# Altium schematic sheet BMS_Interface.SchDoc
size Letter; Website: www.uwmidsun.com
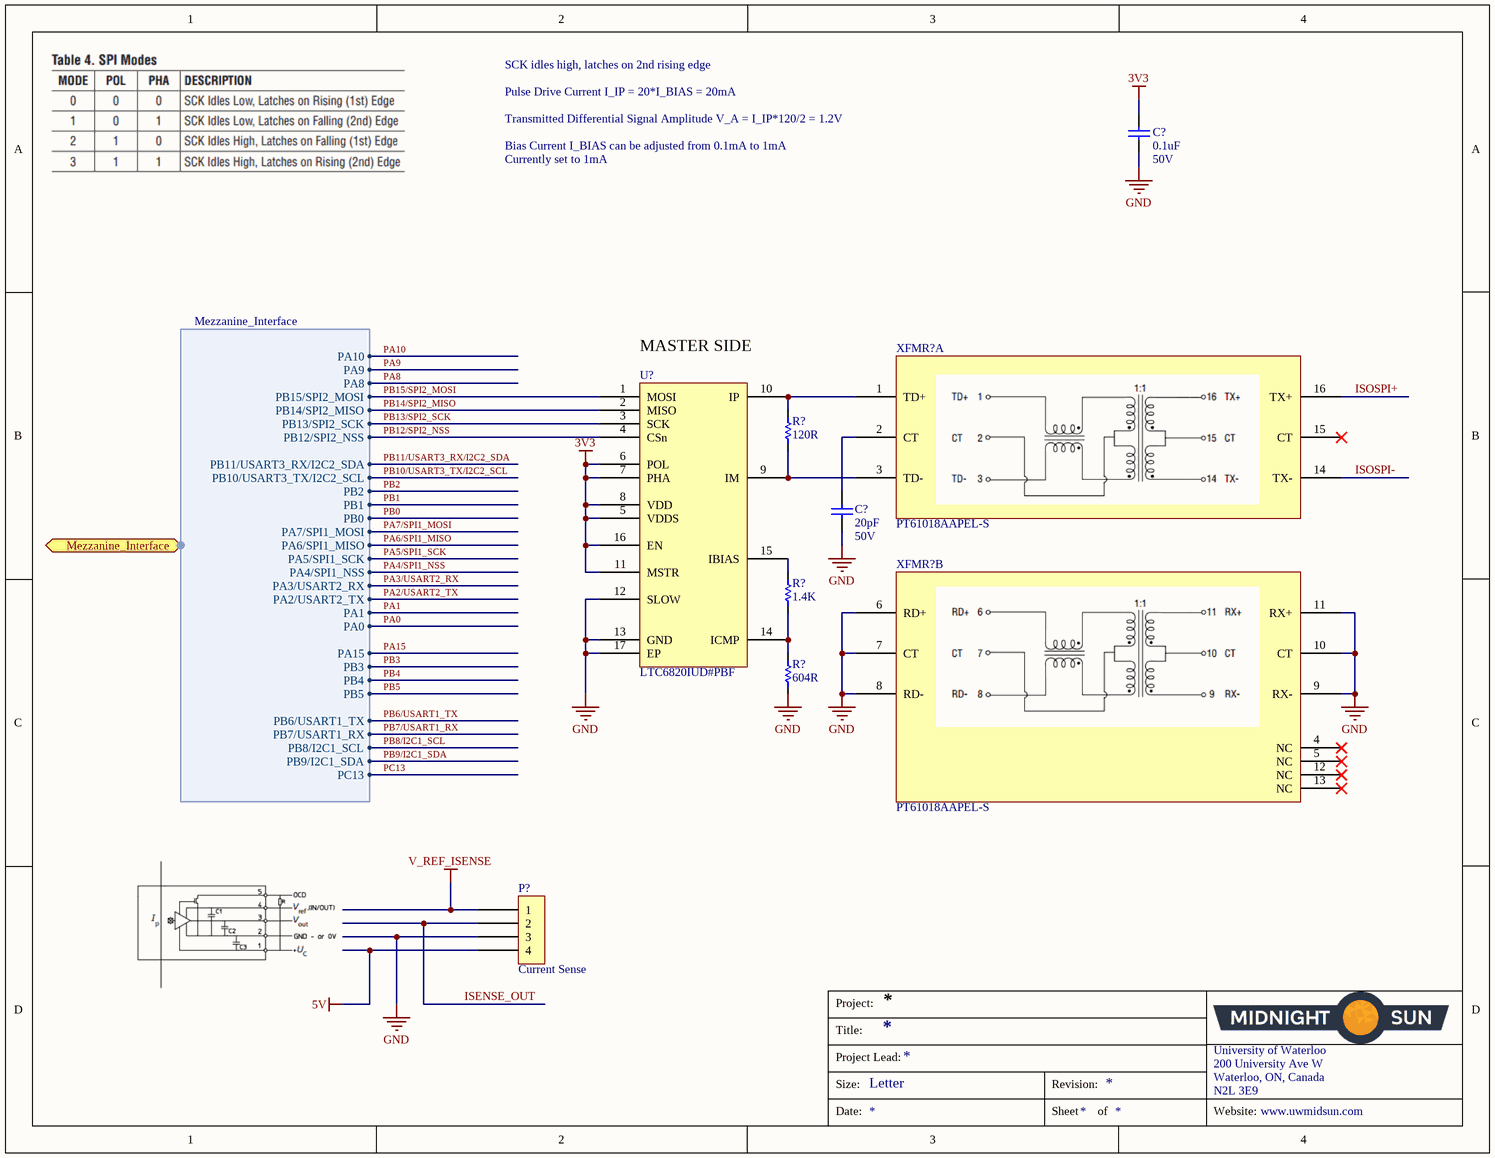
[diagram p0: BMS_Interface.SchDoc]

## Parts
(Parts that share a designator on the sheet are numbered #1, #2 ... from top to bottom, then left to right.)
C?#1  0.1uF  Voltage: 50V  [CAPC1608X06N]
C?#2  20pF  Voltage: 50V  [CAPC1608X06N]
P?  Current Sense  [WM4781CT-ND]
R?#1  120R  [RESC1608X06N]
R?#2  1.4K  [RESC1608X06N]
R?#3  604R  [RESC1608X06N]
U?  Manufacturer_PN: LTC6820IUD#PBF  (hidden comment: IC, LTC6820IUD#PBF)
XFMR?#1  MFG_PN: PT61018AAPEL-S  [IC, PULSE XFMR 1CT:1CT 350UH SMD]  (hidden comment: IC, PULSE XFMR 1CT:1CT 350UH SMD)  (part A of 2)
XFMR?#2  MFG_PN: PT61018AAPEL-S  [IC, PULSE XFMR 1CT:1CT 350UH SMD]  (hidden comment: IC, PULSE XFMR 1CT:1CT 350UH SMD)  (part B of 2)

## Ports
Mezzanine_Interface (harness Mezzanine_Interface)

## Harnesses
Mezzanine_Interface: PA10, PA9, PA8, PB15/SPI2_MOSI, PB14/SPI2_MISO, PB13/SPI2_SCK, PB12/SPI2_NSS, PB11/USART3_RX/I2C2_SDA, PB10/USART3_TX/I2C2_SCL, PB2, PB1, PB0, PA7/SPI1_MOSI, PA6/SPI1_MISO, PA5/SPI1_SCK, PA4/SPI1_NSS, PA3/USART2_RX, PA2/USART2_TX, PA1, PA0, PA15, PB3, PB4, PB5, PB6/USART1_TX, PB7/USART1_RX, PB8/I2C1_SCL, PB9/I2C1_SDA, PC13

## Nets
3V3: C?#1.2 U?.5(VDDS) U?.6(POL) U?.7(PHA) U?.8(VDD) U?.11(MSTR) U?.16(EN)
5V: P?.4
GND: C?#1.1 C?#2.1 P?.3 R?#3.1 U?.12(SLOW) U?.13(GND) U?.17(EP) XFMR?#2.6(RD+) XFMR?#2.7(CT) XFMR?#2.8(RD-) XFMR?#2.9(RX-) XFMR?#2.10(CT) XFMR?#2.11(RX+)
V_REF_ISENSE: P?.1
ISENSE_OUT: P?.2
ISOSPI+: XFMR?#1.16(TX+)
ISOSPI-: XFMR?#1.14(TX-)
PA0: port Mezzanine_Interface.PA0
PA1: port Mezzanine_Interface.PA1
PA2/USART2_TX: port Mezzanine_Interface.PA2/USART2_TX
PA3/USART2_RX: port Mezzanine_Interface.PA3/USART2_RX
PA4/SPI1_NSS: port Mezzanine_Interface.PA4/SPI1_NSS
PA5/SPI1_SCK: port Mezzanine_Interface.PA5/SPI1_SCK
PA6/SPI1_MISO: port Mezzanine_Interface.PA6/SPI1_MISO
PA7/SPI1_MOSI: port Mezzanine_Interface.PA7/SPI1_MOSI
PA8: port Mezzanine_Interface.PA8
PA9: port Mezzanine_Interface.PA9
PA10: port Mezzanine_Interface.PA10
PA15: port Mezzanine_Interface.PA15
PB0: port Mezzanine_Interface.PB0
PB1: port Mezzanine_Interface.PB1
PB2: port Mezzanine_Interface.PB2
PB3: port Mezzanine_Interface.PB3
PB4: port Mezzanine_Interface.PB4
PB5: port Mezzanine_Interface.PB5
PB6/USART1_TX: port Mezzanine_Interface.PB6/USART1_TX
PB7/USART1_RX: port Mezzanine_Interface.PB7/USART1_RX
PB8/I2C1_SCL: port Mezzanine_Interface.PB8/I2C1_SCL
PB9/I2C1_SDA: port Mezzanine_Interface.PB9/I2C1_SDA
PB10/USART3_TX/I2C2_SCL: port Mezzanine_Interface.PB10/USART3_TX/I2C2_SCL
PB11/USART3_RX/I2C2_SDA: port Mezzanine_Interface.PB11/USART3_RX/I2C2_SDA
PB12/SPI2_NSS: U?.4(CSn) ; port Mezzanine_Interface.PB12/SPI2_NSS
PB13/SPI2_SCK: U?.3(SCK) ; port Mezzanine_Interface.PB13/SPI2_SCK
PB14/SPI2_MISO: U?.2(MISO) ; port Mezzanine_Interface.PB14/SPI2_MISO
PB15/SPI2_MOSI: U?.1(MOSI) ; port Mezzanine_Interface.PB15/SPI2_MOSI
PC13: port Mezzanine_Interface.PC13
NetC?#2_2: C?#2.2 XFMR?#1.2(CT)
NetR?#1_1: R?#1.1 U?.9(IM) XFMR?#1.3(TD-)
NetR?#1_2: R?#1.2 U?.10(IP) XFMR?#1.1(TD+)
NetR?#2_1: R?#2.1 R?#3.2 U?.14(ICMP)
NetR?#2_2: R?#2.2 U?.15(IBIAS)

Not connected (* = marked no-connect by the designer): XFMR?#1 15(CT)*; XFMR?#2 4(NC)* 5(NC)* 12(NC)* 13(NC)*

## Notes on the sheet
- Pulse Drive Current I_IP = 20*I_BIAS = 20mA
- SCK idles high, latches on 2nd rising edge
- Bias Current I_BIAS can be adjusted from 0.1mA to 1mA
- Currently set to 1mA
- Transmitted Differential Signal Amplitude V_A = I_IP*120/2 = 1.2V
- (near U?) MASTER SIDE
- Project:
- Title:
- Size:
- Project Lead:
- Letter
- Revision:
- University of Waterloo
- 200 University Ave W
- Waterloo, ON, Canada
- N2L 3E9
- Date:
- Sheet
- of
- Website:

## Library data of the parts
C?#1 = CAP CER 0.1UF 50V 10% X7R 0603: 0.10µF ±10% 50V Ceramic Capacitor X7R 0603 (1608 Metric); Manufacturer: AVX Corporation; ManufacturerPartNumber: 06035C104KAT2A; Value: 0.1uF; Supplier: Digi-Key; SupplierPartNumber: 478-5052-1-ND
C?#2 = CAP CER 20PF 100V 5% NP0 0603: 22pF 100V Ceramic Capacitor C0G, NP0 0603 (1608 Metric) 0.063" L x 0.031" W (1.60mm x 0.80mm); ManufacturerPartNumber: GCM1885C2A220JA16D; Manufacturer: Murata Electronics North America; Value: 20pF; SupplierPartNumber: 490-4942-1-ND; Supplier: Digi-Key
P? = 4 Position Clik-Mate SWD Connector: 4 Position Receptacle Connector 0.049" (1.25mm) Surface Mount Tin; Maufacturer Part Number: 5023820470; Digikey Part Number: WM4781CT-ND; Supplier 1: Digi-Key; Supplier Part Number 1: WM4781CT-ND
R?#1-R?#3 = RES 0.0 OHM 1/4W 0603: RES SMD 0.0 OHM JUMPER 1/4W 0603; Manufacture: Vishay Dale; Manufacture Part Number: CRCW06030000Z0EAHP; Power (W): 0.25; Resistance: 0.0; Supplier 1: Digi-Key; Supplier Part Number 1: 541-0.0SBCT-ND; Package: 0603
U? = IC, LTC6820IUD#PBF: IC COMM INTERFACE ISOSPI 16-QFN; Manufacturer: Linear Technology; Supplier: Digikey; Supplier_PN: LTC6820IUD#PBF-ND
XFMR?#1 XFMR?#2 = IC, PULSE XFMR 1CT:1CT 350UH SMD: PULSE XFMR 1CT:1CT 350UH SMD; Manufacturer: Bourns Inc.; Isolation Voltage: 1.5kVrms; Supplier: Digikey; Supplier_PN: PT61018AAPEL-SCT-ND; Inductance: 350uH